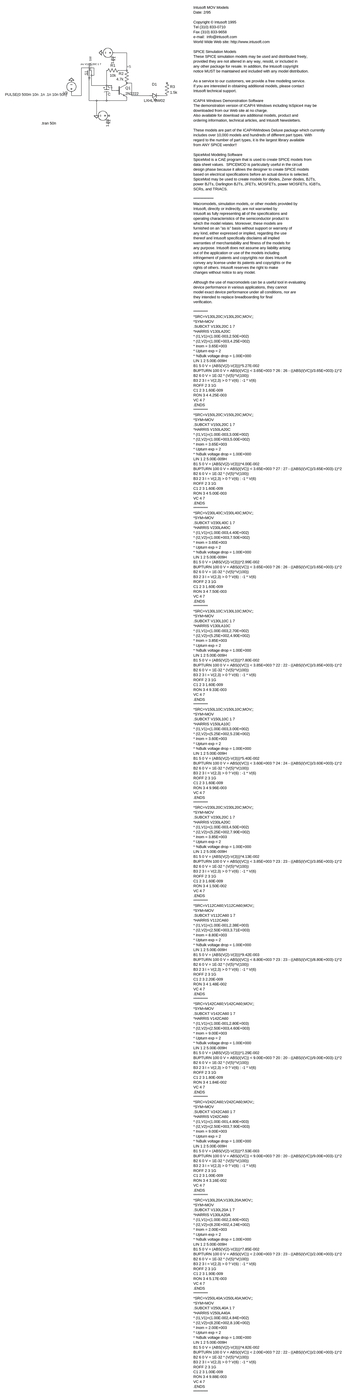
[diagram p0: schematic SIM2 debouncer S1.asc, whole sheet]
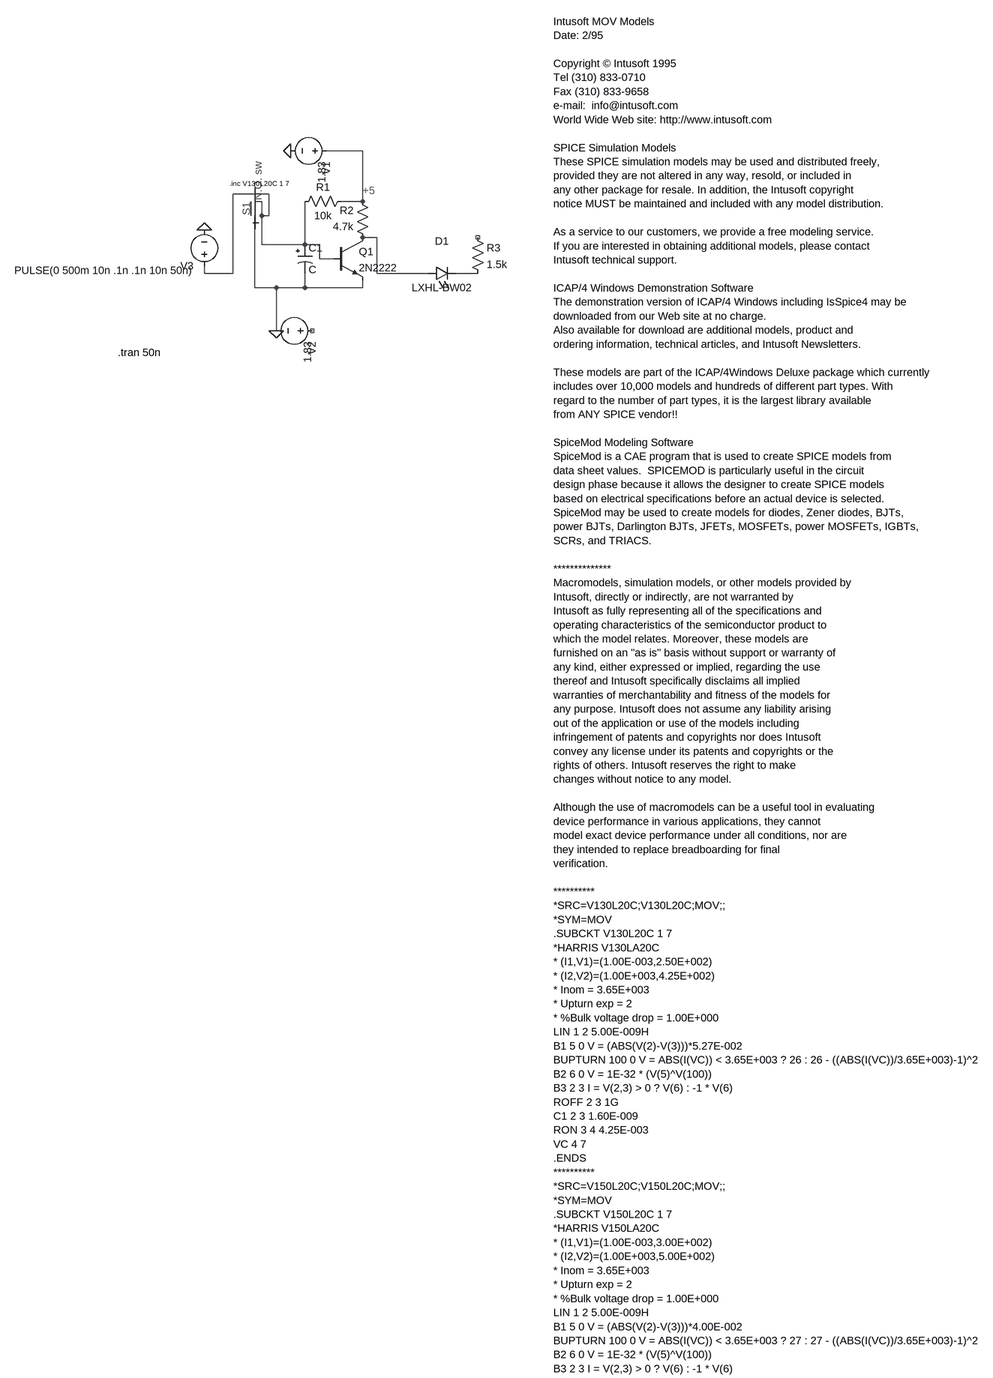
[diagram p1: schematic SIM2 debouncer S1.asc, part, row 1 of 3, column 1 of 1]
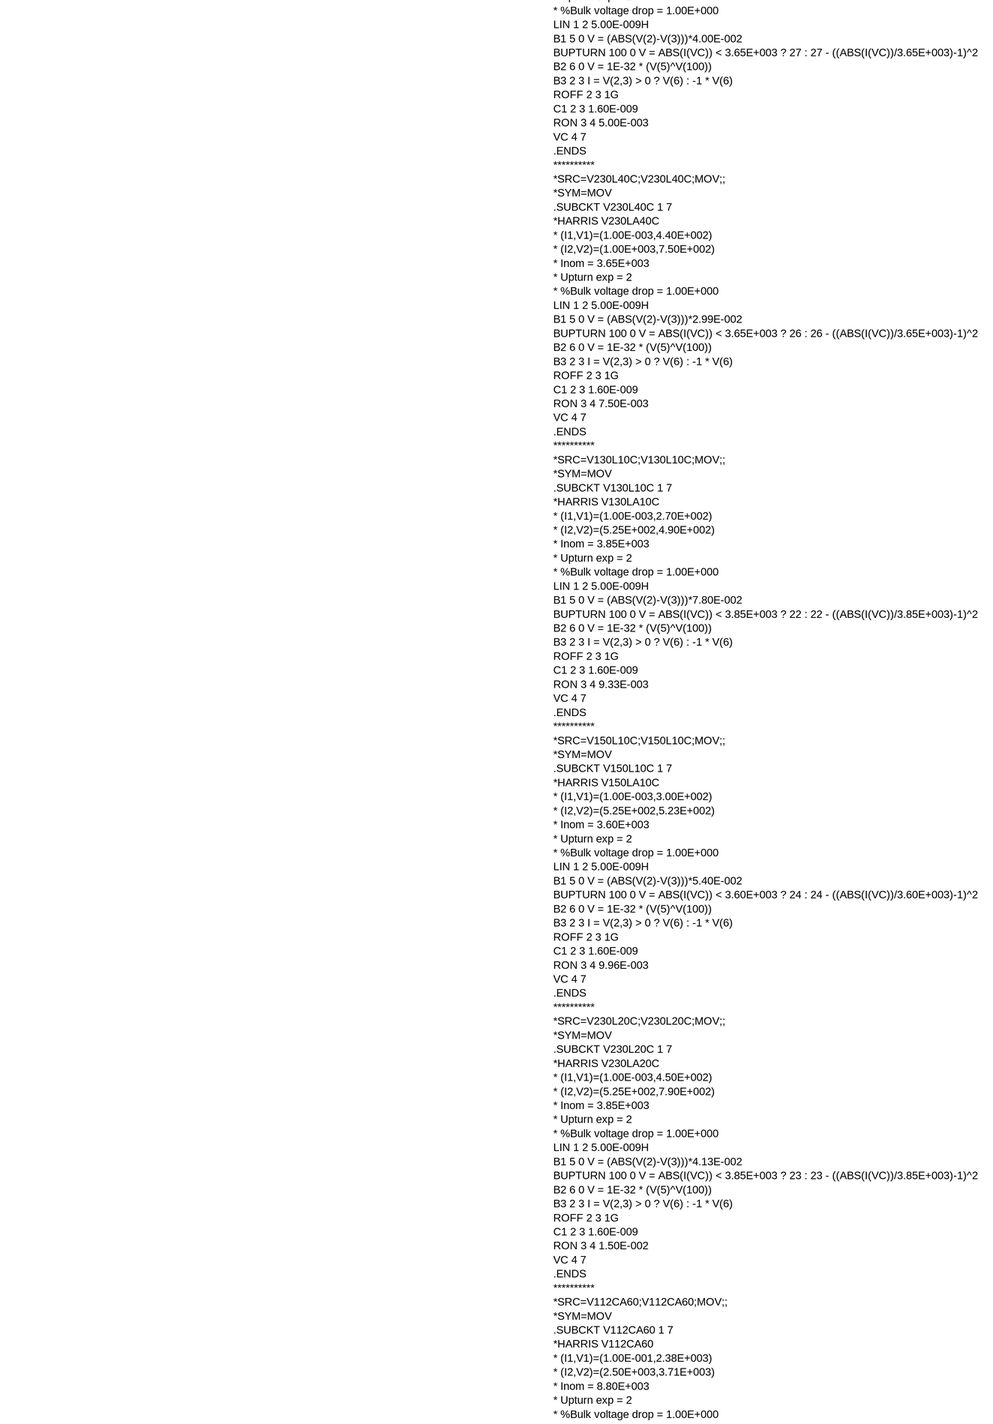
[diagram p2: schematic SIM2 debouncer S1.asc, part, row 2 of 3, column 1 of 1]
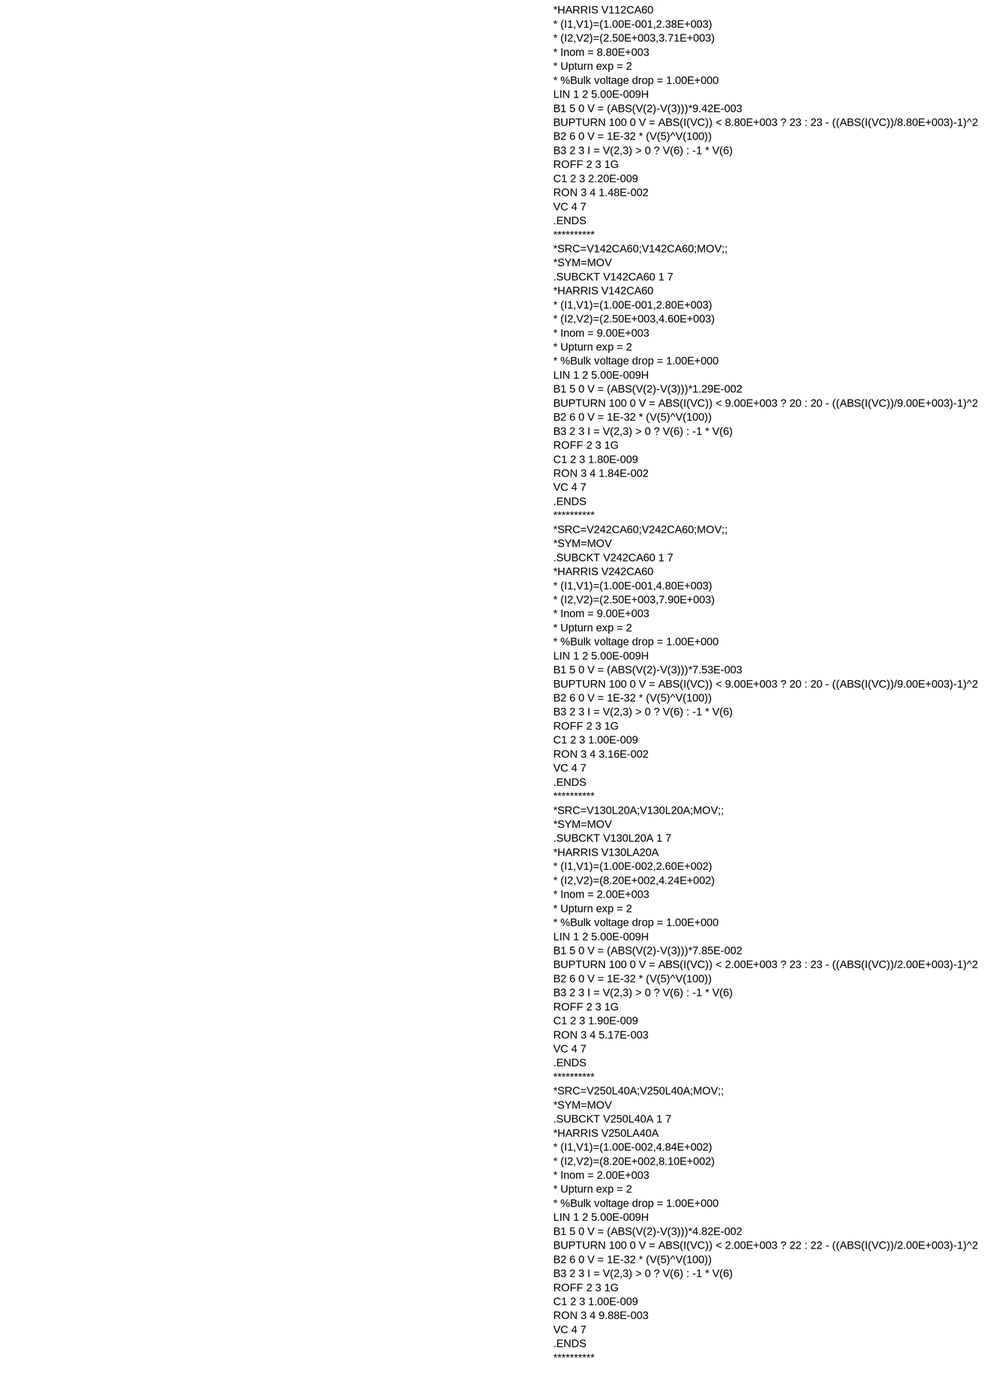
[diagram p3: schematic SIM2 debouncer S1.asc, part, row 3 of 3, column 1 of 1]
SIM2 debouncer S1.asc, the LTspice schematic file:
Version 4
SHEET 1 1128 2524
WIRE 208 -16 128 -16
WIRE 0 80 -80 80
WIRE -16 96 -32 96
WIRE 208 96 208 -16
WIRE 208 96 160 96
WIRE -16 128 -16 96
WIRE 0 128 0 80
WIRE 0 128 -16 128
WIRE 240 176 208 176
WIRE -16 192 -16 128
WIRE 80 192 80 96
WIRE 80 192 -16 192
WIRE 112 192 80 192
WIRE 112 224 112 192
WIRE 144 224 112 224
WIRE -144 256 -144 240
WIRE -80 256 -80 80
WIRE -80 256 -144 256
WIRE 240 256 240 176
WIRE 352 256 240 256
WIRE 464 256 416 256
WIRE -32 288 -32 128
WIRE 16 288 -32 288
WIRE 80 288 80 256
WIRE 80 288 16 288
WIRE 208 288 208 272
WIRE 208 288 80 288
WIRE 16 384 16 288
FLAG 48 -16 0
FLAG 16 384 0
FLAG -144 160 0
SYMBOL LED 352 272 R270
WINDOW 0 72 32 VTop 2
WINDOW 3 0 32 VBottom 2
SYMATTR InstName D1
SYMATTR Value LXHL-BW02
SYMBOL polcap 64 192 R0
SYMATTR InstName C1
SYMBOL res 176 80 R90
WINDOW 0 0 56 VBottom 2
WINDOW 3 32 56 VTop 2
SYMATTR InstName R1
SYMATTR Value 10k
SYMBOL res 224 192 R180
WINDOW 0 36 76 Left 2
WINDOW 3 36 40 Left 2
SYMATTR InstName R2
SYMATTR Value 4.7k
SYMBOL npn 144 176 R0
SYMATTR InstName Q1
SYMATTR Value 2N2222
SYMBOL res 448 160 R0
SYMATTR InstName R3
SYMATTR Value 1.5k
SYMBOL voltage 144 -16 R90
WINDOW 3 24 26 Left 2
WINDOW 123 0 0 Left 2
WINDOW 39 24 106 Left 2
SYMATTR Value 1.83
SYMATTR InstName V1
SYMBOL voltage 112 384 R90
WINDOW 3 24 26 Left 2
WINDOW 123 0 0 Left 2
WINDOW 39 24 106 Left 2
SYMATTR Value 1.83
SYMATTR InstName V2
SYMBOL voltage -144 256 R180
WINDOW 123 0 0 Left 2
WINDOW 39 24 106 Left 2
WINDOW 3 24 6 Left 2
SYMATTR Value PULSE(0 500m 10n .1n .1n 10n 50n)
SYMATTR InstName V3
SYMBOL Misc\\Momentary\ switch -32 112 R270
WINDOW 38 1 -18 Center 2
WINDOW 0 0 0 Invisible 2
SYMATTR SpiceModel ""
SYMATTR InstName U1
TEXT 208 72 Left 2 ;+5
TEXT -336 432 Left 2 !.tran 50n
TEXT 744 -304 Left 2 !Intusoft MOV Models\nDate: 2/95\n \nCopyright © Intusoft 1995\nTel (310) 833-0710\nFax (310) 833-9658\ne-mail:  info@intusoft.com\nWorld Wide Web site: http://www.intusoft.com\n \nSPICE Simulation Models\nThese SPICE simulation models may be used and distributed freely, \nprovided they are not altered in any way, resold, or included in \nany other package for resale. In addition, the Intusoft copyright\nnotice MUST be maintained and included with any model distribution.\n \nAs a service to our customers, we provide a free modeling service.  \nIf you are interested in obtaining additional models, please contact \nIntusoft technical support.\n \nICAP/4 Windows Demonstration Software\nThe demonstration version of ICAP/4 Windows including IsSpice4 may be \ndownloaded from our Web site at no charge.  \nAlso available for download are additional models, product and \nordering information, technical articles, and Intusoft Newsletters.\n \nThese models are part of the ICAP/4Windows Deluxe package which currently\nincludes over 10,000 models and hundreds of different part types. With\nregard to the number of part types, it is the largest library available\nfrom ANY SPICE vendor!!\n \nSpiceMod Modeling Software\nSpiceMod is a CAE program that is used to create SPICE models from \ndata sheet values.  SPICEMOD is particularly useful in the circuit \ndesign phase because it allows the designer to create SPICE models \nbased on electrical specifications before an actual device is selected.\nSpiceMod may be used to create models for diodes, Zener diodes, BJTs,\npower BJTs, Darlington BJTs, JFETs, MOSFETs, power MOSFETs, IGBTs, \nSCRs, and TRIACS.\n \n**************\nMacromodels, simulation models, or other models provided by\nIntusoft, directly or indirectly, are not warranted by\nIntusoft as fully representing all of the specifications and\noperating characteristics of the semiconductor product to\nwhich the model relates. Moreover, these models are\nfurnished on an "as is" basis without support or warranty of\nany kind, either expressed or implied, regarding the use\nthereof and Intusoft specifically disclaims all implied\nwarranties of merchantability and fitness of the models for\nany purpose. Intusoft does not assume any liability arising\nout of the application or use of the models including\ninfringement of patents and copyrights nor does Intusoft\nconvey any license under its patents and copyrights or the\nrights of others. Intusoft reserves the right to make\nchanges without notice to any model.\n \nAlthough the use of macromodels can be a useful tool in evaluating\ndevice performance in various applications, they cannot\nmodel exact device performance under all conditions, nor are\nthey intended to replace breadboarding for final\nverification.\n \n**********\n*SRC=V130L20C;V130L20C;MOV;;\n*SYM=MOV\n.SUBCKT V130L20C 1 7\n*HARRIS V130LA20C\n* (I1,V1)=(1.00E-003,2.50E+002)\n* (I2,V2)=(1.00E+003,4.25E+002)\n* Inom = 3.65E+003\n* Upturn exp = 2\n* %Bulk voltage drop = 1.00E+000\nLIN 1 2 5.00E-009H\nB1 5 0 V = (ABS(V(2)-V(3)))*5.27E-002\nBUPTURN 100 0 V = ABS(I(VC)) < 3.65E+003 ? 26 : 26 - ((ABS(I(VC))/3.65E+003)-1)^2\nB2 6 0 V = 1E-32 * (V(5)^V(100))\nB3 2 3 I = V(2,3) > 0 ? V(6) : -1 * V(6)\nROFF 2 3 1G\nC1 2 3 1.60E-009\nRON 3 4 4.25E-003\nVC 4 7\n.ENDS\n**********\n*SRC=V150L20C;V150L20C;MOV;;\n*SYM=MOV\n.SUBCKT V150L20C 1 7\n*HARRIS V150LA20C\n* (I1,V1)=(1.00E-003,3.00E+002)\n* (I2,V2)=(1.00E+003,5.00E+002)\n* Inom = 3.65E+003\n* Upturn exp = 2\n* %Bulk voltage drop = 1.00E+000\nLIN 1 2 5.00E-009H\nB1 5 0 V = (ABS(V(2)-V(3)))*4.00E-002\nBUPTURN 100 0 V = ABS(I(VC)) < 3.65E+003 ? 27 : 27 - ((ABS(I(VC))/3.65E+003)-1)^2\nB2 6 0 V = 1E-32 * (V(5)^V(100))\nB3 2 3 I = V(2,3) > 0 ? V(6) : -1 * V(6)\nROFF 2 3 1G\nC1 2 3 1.60E-009\nRON 3 4 5.00E-003\nVC 4 7\n.ENDS\n**********\n*SRC=V230L40C;V230L40C;MOV;;\n*SYM=MOV\n.SUBCKT V230L40C 1 7\n*HARRIS V230LA40C\n* (I1,V1)=(1.00E-003,4.40E+002)\n* (I2,V2)=(1.00E+003,7.50E+002)\n* Inom = 3.65E+003\n* Upturn exp = 2\n* %Bulk voltage drop = 1.00E+000\nLIN 1 2 5.00E-009H\nB1 5 0 V = (ABS(V(2)-V(3)))*2.99E-002\nBUPTURN 100 0 V = ABS(I(VC)) < 3.65E+003 ? 26 : 26 - ((ABS(I(VC))/3.65E+003)-1)^2\nB2 6 0 V = 1E-32 * (V(5)^V(100))\nB3 2 3 I = V(2,3) > 0 ? V(6) : -1 * V(6)\nROFF 2 3 1G\nC1 2 3 1.60E-009\nRON 3 4 7.50E-003\nVC 4 7\n.ENDS\n**********\n*SRC=V130L10C;V130L10C;MOV;;\n*SYM=MOV\n.SUBCKT V130L10C 1 7\n*HARRIS V130LA10C\n* (I1,V1)=(1.00E-003,2.70E+002)\n* (I2,V2)=(5.25E+002,4.90E+002)\n* Inom = 3.85E+003\n* Upturn exp = 2\n* %Bulk voltage drop = 1.00E+000\nLIN 1 2 5.00E-009H\nB1 5 0 V = (ABS(V(2)-V(3)))*7.80E-002\nBUPTURN 100 0 V = ABS(I(VC)) < 3.85E+003 ? 22 : 22 - ((ABS(I(VC))/3.85E+003)-1)^2\nB2 6 0 V = 1E-32 * (V(5)^V(100))\nB3 2 3 I = V(2,3) > 0 ? V(6) : -1 * V(6)\nROFF 2 3 1G\nC1 2 3 1.60E-009\nRON 3 4 9.33E-003\nVC 4 7\n.ENDS\n**********\n*SRC=V150L10C;V150L10C;MOV;;\n*SYM=MOV\n.SUBCKT V150L10C 1 7\n*HARRIS V150LA10C\n* (I1,V1)=(1.00E-003,3.00E+002)\n* (I2,V2)=(5.25E+002,5.23E+002)\n* Inom = 3.60E+003\n* Upturn exp = 2\n* %Bulk voltage drop = 1.00E+000\nLIN 1 2 5.00E-009H\nB1 5 0 V = (ABS(V(2)-V(3)))*5.40E-002\nBUPTURN 100 0 V = ABS(I(VC)) < 3.60E+003 ? 24 : 24 - ((ABS(I(VC))/3.60E+003)-1)^2\nB2 6 0 V = 1E-32 * (V(5)^V(100))\nB3 2 3 I = V(2,3) > 0 ? V(6) : -1 * V(6)\nROFF 2 3 1G\nC1 2 3 1.60E-009\nRON 3 4 9.96E-003\nVC 4 7\n.ENDS\n**********\n*SRC=V230L20C;V230L20C;MOV;;\n*SYM=MOV\n.SUBCKT V230L20C 1 7\n*HARRIS V230LA20C\n* (I1,V1)=(1.00E-003,4.50E+002)\n* (I2,V2)=(5.25E+002,7.90E+002)\n* Inom = 3.85E+003\n* Upturn exp = 2\n* %Bulk voltage drop = 1.00E+000\nLIN 1 2 5.00E-009H\nB1 5 0 V = (ABS(V(2)-V(3)))*4.13E-002\nBUPTURN 100 0 V = ABS(I(VC)) < 3.85E+003 ? 23 : 23 - ((ABS(I(VC))/3.85E+003)-1)^2\nB2 6 0 V = 1E-32 * (V(5)^V(100))\nB3 2 3 I = V(2,3) > 0 ? V(6) : -1 * V(6)\nROFF 2 3 1G\nC1 2 3 1.60E-009\nRON 3 4 1.50E-002\nVC 4 7\n.ENDS\n**********\n*SRC=V112CA60;V112CA60;MOV;;\n*SYM=MOV\n.SUBCKT V112CA60 1 7\n*HARRIS V112CA60\n* (I1,V1)=(1.00E-001,2.38E+003)\n* (I2,V2)=(2.50E+003,3.71E+003)\n* Inom = 8.80E+003\n* Upturn exp = 2\n* %Bulk voltage drop = 1.00E+000\nLIN 1 2 5.00E-009H\nB1 5 0 V = (ABS(V(2)-V(3)))*9.42E-003\nBUPTURN 100 0 V = ABS(I(VC)) < 8.80E+003 ? 23 : 23 - ((ABS(I(VC))/8.80E+003)-1)^2\nB2 6 0 V = 1E-32 * (V(5)^V(100))\nB3 2 3 I = V(2,3) > 0 ? V(6) : -1 * V(6)\nROFF 2 3 1G\nC1 2 3 2.20E-009\nRON 3 4 1.48E-002\nVC 4 7\n.ENDS\n**********\n*SRC=V142CA60;V142CA60;MOV;;\n*SYM=MOV\n.SUBCKT V142CA60 1 7\n*HARRIS V142CA60\n* (I1,V1)=(1.00E-001,2.80E+003)\n* (I2,V2)=(2.50E+003,4.60E+003)\n* Inom = 9.00E+003\n* Upturn exp = 2\n* %Bulk voltage drop = 1.00E+000\nLIN 1 2 5.00E-009H\nB1 5 0 V = (ABS(V(2)-V(3)))*1.29E-002\nBUPTURN 100 0 V = ABS(I(VC)) < 9.00E+003 ? 20 : 20 - ((ABS(I(VC))/9.00E+003)-1)^2\nB2 6 0 V = 1E-32 * (V(5)^V(100))\nB3 2 3 I = V(2,3) > 0 ? V(6) : -1 * V(6)\nROFF 2 3 1G\nC1 2 3 1.80E-009\nRON 3 4 1.84E-002\nVC 4 7\n.ENDS\n**********\n*SRC=V242CA60;V242CA60;MOV;;\n*SYM=MOV\n.SUBCKT V242CA60 1 7\n*HARRIS V242CA60\n* (I1,V1)=(1.00E-001,4.80E+003)\n* (I2,V2)=(2.50E+003,7.90E+003)\n* Inom = 9.00E+003\n* Upturn exp = 2\n* %Bulk voltage drop = 1.00E+000\nLIN 1 2 5.00E-009H\nB1 5 0 V = (ABS(V(2)-V(3)))*7.53E-003\nBUPTURN 100 0 V = ABS(I(VC)) < 9.00E+003 ? 20 : 20 - ((ABS(I(VC))/9.00E+003)-1)^2\nB2 6 0 V = 1E-32 * (V(5)^V(100))\nB3 2 3 I = V(2,3) > 0 ? V(6) : -1 * V(6)\nROFF 2 3 1G\nC1 2 3 1.00E-009\nRON 3 4 3.16E-002\nVC 4 7\n.ENDS\n**********\n*SRC=V130L20A;V130L20A;MOV;;\n*SYM=MOV\n.SUBCKT V130L20A 1 7\n*HARRIS V130LA20A\n* (I1,V1)=(1.00E-002,2.60E+002)\n* (I2,V2)=(8.20E+002,4.24E+002)\n* Inom = 2.00E+003\n* Upturn exp = 2\n* %Bulk voltage drop = 1.00E+000\nLIN 1 2 5.00E-009H\nB1 5 0 V = (ABS(V(2)-V(3)))*7.85E-002\nBUPTURN 100 0 V = ABS(I(VC)) < 2.00E+003 ? 23 : 23 - ((ABS(I(VC))/2.00E+003)-1)^2\nB2 6 0 V = 1E-32 * (V(5)^V(100))\nB3 2 3 I = V(2,3) > 0 ? V(6) : -1 * V(6)\nROFF 2 3 1G\nC1 2 3 1.90E-009\nRON 3 4 5.17E-003\nVC 4 7\n.ENDS\n**********\n*SRC=V250L40A;V250L40A;MOV;;\n*SYM=MOV\n.SUBCKT V250L40A 1 7\n*HARRIS V250LA40A\n* (I1,V1)=(1.00E-002,4.84E+002)\n* (I2,V2)=(8.20E+002,8.10E+002)\n* Inom = 2.00E+003\n* Upturn exp = 2\n* %Bulk voltage drop = 1.00E+000\nLIN 1 2 5.00E-009H\nB1 5 0 V = (ABS(V(2)-V(3)))*4.82E-002\nBUPTURN 100 0 V = ABS(I(VC)) < 2.00E+003 ? 22 : 22 - ((ABS(I(VC))/2.00E+003)-1)^2\nB2 6 0 V = 1E-32 * (V(5)^V(100))\nB3 2 3 I = V(2,3) > 0 ? V(6) : -1 * V(6)\nROFF 2 3 1G\nC1 2 3 1.00E-009\nRON 3 4 9.88E-003\nVC 4 7\n.ENDS\n**********
TEXT -88 56 Left 1 !.inc V130L20C 1 7

The netlist it stands for:
* SIM2 debouncer S1.asc
D1 N003 N004 LXHL-BW02
C1 N002 0 C
R1 N001 N002 10k
R2 N003 N001 4.7k
Q1 N003 N002 0 0 2N2222
R3 NC_01 N004 1.5k
V1 N001 0 1.83
V2 NC_02 0 1.83
V3 N002 0 PULSE(0 500m 10n .1n .1n 10n 50n)
S§U1 0 N002 trigger switch
.model D D
.lib standard.dio
.model NPN NPN
.model PNP PNP
.lib standard.bjt
* +5
.tran 50n
Intusoft MOV Models
Date: 2/95
Copyright © Intusoft 1995
Tel (310) 833-0710
Fax (310) 833-9658
e-mail:  info@intusoft.com
World Wide Web site: http://www.intusoft.com
SPICE Simulation Models
These SPICE simulation models may be used and distributed freely,
provided they are not altered in any way, resold, or included in
any other package for resale. In addition, the Intusoft copyright
notice MUST be maintained and included with any model distribution.
As a service to our customers, we provide a free modeling service.
If you are interested in obtaining additional models, please contact
Intusoft technical support.
ICAP/4 Windows Demonstration Software
The demonstration version of ICAP/4 Windows including IsSpice4 may be
downloaded from our Web site at no charge.
Also available for download are additional models, product and
ordering information, technical articles, and Intusoft Newsletters.
These models are part of the ICAP/4Windows Deluxe package which currently
includes over 10,000 models and hundreds of different part types. With
regard to the number of part types, it is the largest library available
from ANY SPICE vendor!!
SpiceMod Modeling Software
SpiceMod is a CAE program that is used to create SPICE models from
data sheet values.  SPICEMOD is particularly useful in the circuit
design phase because it allows the designer to create SPICE models
based on electrical specifications before an actual device is selected.
SpiceMod may be used to create models for diodes, Zener diodes, BJTs,
power BJTs, Darlington BJTs, JFETs, MOSFETs, power MOSFETs, IGBTs,
SCRs, and TRIACS.
**************
Macromodels, simulation models, or other models provided by
Intusoft, directly or indirectly, are not warranted by
Intusoft as fully representing all of the specifications and
operating characteristics of the semiconductor product to
which the model relates. Moreover, these models are
furnished on an "as is" basis without support or warranty of
any kind, either expressed or implied, regarding the use
thereof and Intusoft specifically disclaims all implied
warranties of merchantability and fitness of the models for
any purpose. Intusoft does not assume any liability arising
out of the application or use of the models including
infringement of patents and copyrights nor does Intusoft
convey any license under its patents and copyrights or the
rights of others. Intusoft reserves the right to make
changes without notice to any model.
Although the use of macromodels can be a useful tool in evaluating
device performance in various applications, they cannot
model exact device performance under all conditions, nor are
they intended to replace breadboarding for final
verification.
**********
*SRC=V130L20C;V130L20C;MOV;;
*SYM=MOV
.SUBCKT V130L20C 1 7
*HARRIS V130LA20C
* (I1,V1)=(1.00E-003,2.50E+002)
* (I2,V2)=(1.00E+003,4.25E+002)
* Inom = 3.65E+003
* Upturn exp = 2
* %Bulk voltage drop = 1.00E+000
LIN 1 2 5.00E-009H
B1 5 0 V = (ABS(V(2)-V(3)))*5.27E-002
BUPTURN 100 0 V = ABS(I(VC)) < 3.65E+003 ? 26 : 26 - ((ABS(I(VC))/3.65E+003)-1)^2
B2 6 0 V = 1E-32 * (V(5)^V(100))
B3 2 3 I = V(2,3) > 0 ? V(6) : -1 * V(6)
ROFF 2 3 1G
C1 2 3 1.60E-009
RON 3 4 4.25E-003
VC 4 7
.ENDS
**********
*SRC=V150L20C;V150L20C;MOV;;
*SYM=MOV
.SUBCKT V150L20C 1 7
*HARRIS V150LA20C
* (I1,V1)=(1.00E-003,3.00E+002)
* (I2,V2)=(1.00E+003,5.00E+002)
* Inom = 3.65E+003
* Upturn exp = 2
* %Bulk voltage drop = 1.00E+000
LIN 1 2 5.00E-009H
B1 5 0 V = (ABS(V(2)-V(3)))*4.00E-002
BUPTURN 100 0 V = ABS(I(VC)) < 3.65E+003 ? 27 : 27 - ((ABS(I(VC))/3.65E+003)-1)^2
B2 6 0 V = 1E-32 * (V(5)^V(100))
B3 2 3 I = V(2,3) > 0 ? V(6) : -1 * V(6)
ROFF 2 3 1G
C1 2 3 1.60E-009
RON 3 4 5.00E-003
VC 4 7
.ENDS
**********
*SRC=V230L40C;V230L40C;MOV;;
*SYM=MOV
.SUBCKT V230L40C 1 7
*HARRIS V230LA40C
* (I1,V1)=(1.00E-003,4.40E+002)
* (I2,V2)=(1.00E+003,7.50E+002)
* Inom = 3.65E+003
* Upturn exp = 2
* %Bulk voltage drop = 1.00E+000
LIN 1 2 5.00E-009H
B1 5 0 V = (ABS(V(2)-V(3)))*2.99E-002
BUPTURN 100 0 V = ABS(I(VC)) < 3.65E+003 ? 26 : 26 - ((ABS(I(VC))/3.65E+003)-1)^2
B2 6 0 V = 1E-32 * (V(5)^V(100))
B3 2 3 I = V(2,3) > 0 ? V(6) : -1 * V(6)
ROFF 2 3 1G
C1 2 3 1.60E-009
RON 3 4 7.50E-003
VC 4 7
.ENDS
**********
*SRC=V130L10C;V130L10C;MOV;;
*SYM=MOV
.SUBCKT V130L10C 1 7
*HARRIS V130LA10C
* (I1,V1)=(1.00E-003,2.70E+002)
* (I2,V2)=(5.25E+002,4.90E+002)
* Inom = 3.85E+003
* Upturn exp = 2
* %Bulk voltage drop = 1.00E+000
LIN 1 2 5.00E-009H
B1 5 0 V = (ABS(V(2)-V(3)))*7.80E-002
BUPTURN 100 0 V = ABS(I(VC)) < 3.85E+003 ? 22 : 22 - ((ABS(I(VC))/3.85E+003)-1)^2
B2 6 0 V = 1E-32 * (V(5)^V(100))
B3 2 3 I = V(2,3) > 0 ? V(6) : -1 * V(6)
ROFF 2 3 1G
C1 2 3 1.60E-009
RON 3 4 9.33E-003
VC 4 7
.ENDS
**********
*SRC=V150L10C;V150L10C;MOV;;
*SYM=MOV
.SUBCKT V150L10C 1 7
*HARRIS V150LA10C
* (I1,V1)=(1.00E-003,3.00E+002)
* (I2,V2)=(5.25E+002,5.23E+002)
* Inom = 3.60E+003
* Upturn exp = 2
* %Bulk voltage drop = 1.00E+000
LIN 1 2 5.00E-009H
B1 5 0 V = (ABS(V(2)-V(3)))*5.40E-002
BUPTURN 100 0 V = ABS(I(VC)) < 3.60E+003 ? 24 : 24 - ((ABS(I(VC))/3.60E+003)-1)^2
B2 6 0 V = 1E-32 * (V(5)^V(100))
B3 2 3 I = V(2,3) > 0 ? V(6) : -1 * V(6)
ROFF 2 3 1G
C1 2 3 1.60E-009
RON 3 4 9.96E-003
VC 4 7
.ENDS
**********
*SRC=V230L20C;V230L20C;MOV;;
*SYM=MOV
.SUBCKT V230L20C 1 7
*HARRIS V230LA20C
* (I1,V1)=(1.00E-003,4.50E+002)
* (I2,V2)=(5.25E+002,7.90E+002)
* Inom = 3.85E+003
* Upturn exp = 2
* %Bulk voltage drop = 1.00E+000
LIN 1 2 5.00E-009H
B1 5 0 V = (ABS(V(2)-V(3)))*4.13E-002
BUPTURN 100 0 V = ABS(I(VC)) < 3.85E+003 ? 23 : 23 - ((ABS(I(VC))/3.85E+003)-1)^2
B2 6 0 V = 1E-32 * (V(5)^V(100))
B3 2 3 I = V(2,3) > 0 ? V(6) : -1 * V(6)
ROFF 2 3 1G
C1 2 3 1.60E-009
RON 3 4 1.50E-002
VC 4 7
.ENDS
**********
*SRC=V112CA60;V112CA60;MOV;;
*SYM=MOV
.SUBCKT V112CA60 1 7
*HARRIS V112CA60
* (I1,V1)=(1.00E-001,2.38E+003)
* (I2,V2)=(2.50E+003,3.71E+003)
* Inom = 8.80E+003
* Upturn exp = 2
* %Bulk voltage drop = 1.00E+000
LIN 1 2 5.00E-009H
B1 5 0 V = (ABS(V(2)-V(3)))*9.42E-003
BUPTURN 100 0 V = ABS(I(VC)) < 8.80E+003 ? 23 : 23 - ((ABS(I(VC))/8.80E+003)-1)^2
B2 6 0 V = 1E-32 * (V(5)^V(100))
B3 2 3 I = V(2,3) > 0 ? V(6) : -1 * V(6)
ROFF 2 3 1G
C1 2 3 2.20E-009
RON 3 4 1.48E-002
VC 4 7
.ENDS
**********
*SRC=V142CA60;V142CA60;MOV;;
*SYM=MOV
.SUBCKT V142CA60 1 7
*HARRIS V142CA60
* (I1,V1)=(1.00E-001,2.80E+003)
* (I2,V2)=(2.50E+003,4.60E+003)
* Inom = 9.00E+003
* Upturn exp = 2
* %Bulk voltage drop = 1.00E+000
LIN 1 2 5.00E-009H
B1 5 0 V = (ABS(V(2)-V(3)))*1.29E-002
BUPTURN 100 0 V = ABS(I(VC)) < 9.00E+003 ? 20 : 20 - ((ABS(I(VC))/9.00E+003)-1)^2
B2 6 0 V = 1E-32 * (V(5)^V(100))
B3 2 3 I = V(2,3) > 0 ? V(6) : -1 * V(6)
ROFF 2 3 1G
C1 2 3 1.80E-009
RON 3 4 1.84E-002
VC 4 7
.ENDS
**********
*SRC=V242CA60;V242CA60;MOV;;
*SYM=MOV
.SUBCKT V242CA60 1 7
*HARRIS V242CA60
* (I1,V1)=(1.00E-001,4.80E+003)
* (I2,V2)=(2.50E+003,7.90E+003)
* Inom = 9.00E+003
* Upturn exp = 2
* %Bulk voltage drop = 1.00E+000
LIN 1 2 5.00E-009H
B1 5 0 V = (ABS(V(2)-V(3)))*7.53E-003
BUPTURN 100 0 V = ABS(I(VC)) < 9.00E+003 ? 20 : 20 - ((ABS(I(VC))/9.00E+003)-1)^2
B2 6 0 V = 1E-32 * (V(5)^V(100))
B3 2 3 I = V(2,3) > 0 ? V(6) : -1 * V(6)
ROFF 2 3 1G
C1 2 3 1.00E-009
RON 3 4 3.16E-002
VC 4 7
.ENDS
**********
*SRC=V130L20A;V130L20A;MOV;;
*SYM=MOV
.SUBCKT V130L20A 1 7
*HARRIS V130LA20A
* (I1,V1)=(1.00E-002,2.60E+002)
* (I2,V2)=(8.20E+002,4.24E+002)
* Inom = 2.00E+003
* Upturn exp = 2
* %Bulk voltage drop = 1.00E+000
LIN 1 2 5.00E-009H
B1 5 0 V = (ABS(V(2)-V(3)))*7.85E-002
BUPTURN 100 0 V = ABS(I(VC)) < 2.00E+003 ? 23 : 23 - ((ABS(I(VC))/2.00E+003)-1)^2
B2 6 0 V = 1E-32 * (V(5)^V(100))
B3 2 3 I = V(2,3) > 0 ? V(6) : -1 * V(6)
ROFF 2 3 1G
C1 2 3 1.90E-009
RON 3 4 5.17E-003
VC 4 7
.ENDS
**********
*SRC=V250L40A;V250L40A;MOV;;
*SYM=MOV
.SUBCKT V250L40A 1 7
*HARRIS V250LA40A
* (I1,V1)=(1.00E-002,4.84E+002)
* (I2,V2)=(8.20E+002,8.10E+002)
* Inom = 2.00E+003
* Upturn exp = 2
* %Bulk voltage drop = 1.00E+000
LIN 1 2 5.00E-009H
B1 5 0 V = (ABS(V(2)-V(3)))*4.82E-002
BUPTURN 100 0 V = ABS(I(VC)) < 2.00E+003 ? 22 : 22 - ((ABS(I(VC))/2.00E+003)-1)^2
B2 6 0 V = 1E-32 * (V(5)^V(100))
B3 2 3 I = V(2,3) > 0 ? V(6) : -1 * V(6)
ROFF 2 3 1G
C1 2 3 1.00E-009
RON 3 4 9.88E-003
VC 4 7
.ENDS
**********
.inc V130L20C 1 7
.backanno
.end